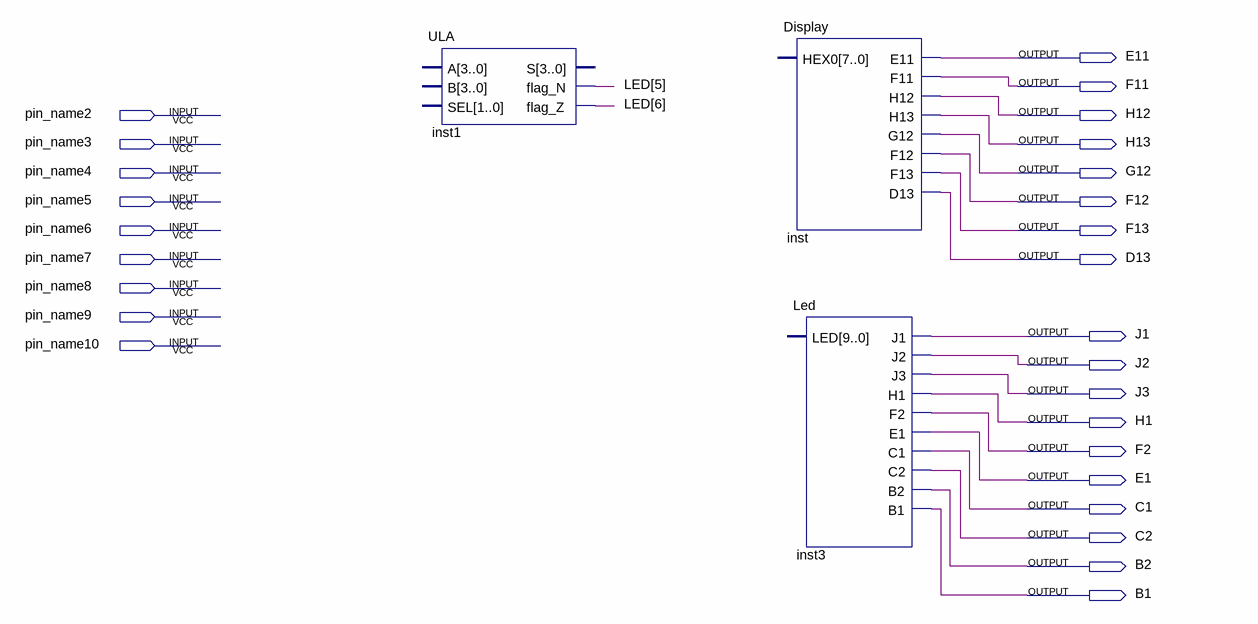
[diagram p0: schematic sheet]
// Quartus schematic UNITL.bdf as structural Verilog: 3 symbols, 27 pins
module UNITL (
  input  pin_name2,
  input  pin_name3,
  input  pin_name4,
  input  pin_name5,
  input  pin_name6,
  input  pin_name7,
  input  pin_name8,
  input  pin_name9,
  input  pin_name10,
  output E11,
  output F11,
  output H12,
  output H13,
  output G12,
  output F12,
  output F13,
  output D13,
  output J1,
  output J2,
  output J3,
  output H1,
  output F2,
  output E1,
  output C1,
  output C2,
  output B2,
  output B1
);

  wire [6:5] LED;

  ULA inst1 (.flag_N(LED[5]), .flag_Z(LED[6]));  // open: A, B, SEL, S
  Display inst (.E11(E11), .F11(F11), .H12(H12), .H13(H13), .G12(G12), .F12(F12), .F13(F13), .D13(D13));  // open: HEX0
  Led inst3 (.J1(J1), .J2(J2), .J3(J3), .H1(H1), .F2(F2), .E1(E1), .C1(C1), .C2(C2), .B2(B2), .B1(B1));  // open: LED
endmodule
